# EAGLE schematic stm32f103_ethernet_shield_2 (EAGLE 9.6.2)
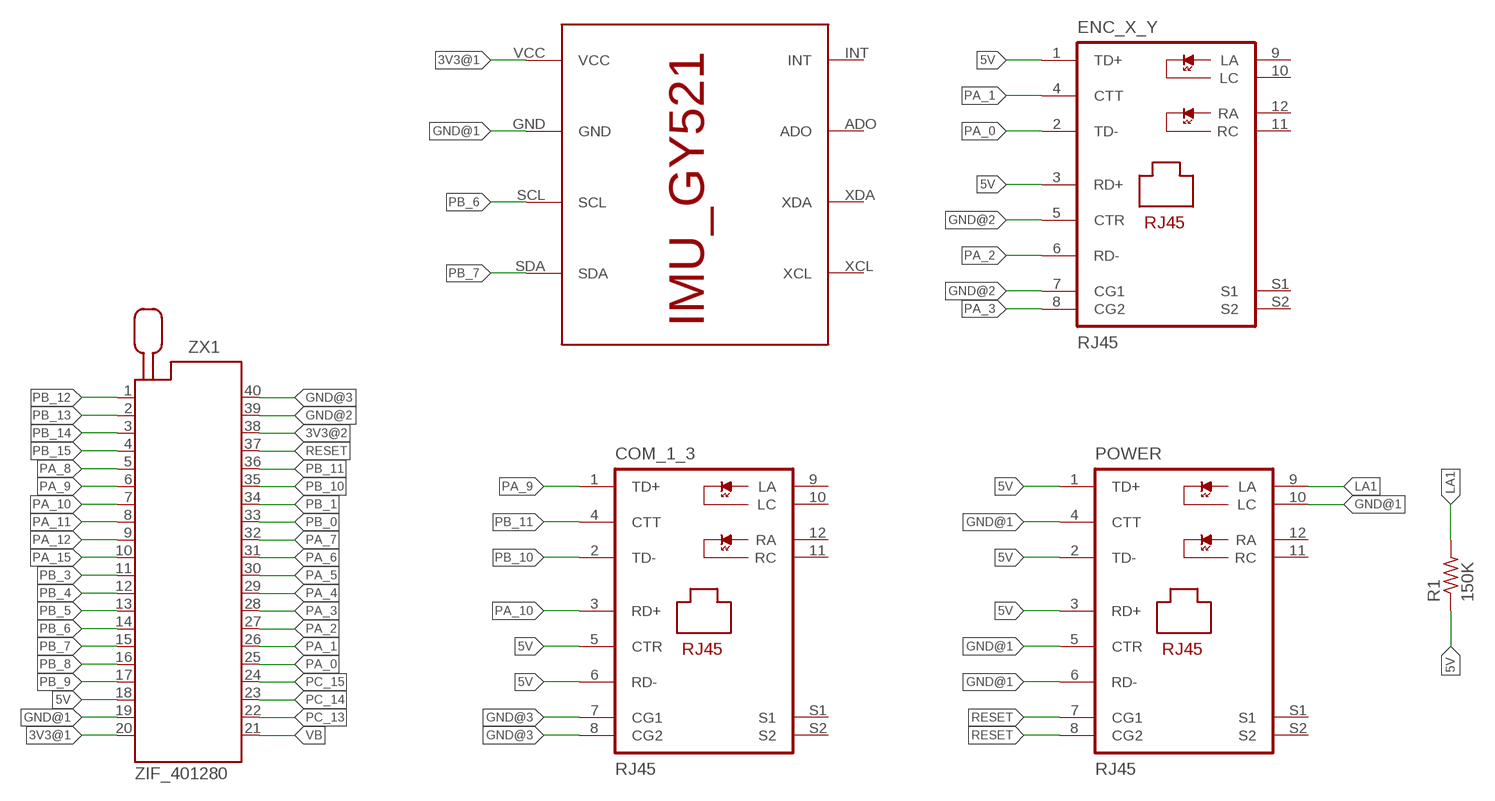
[diagram p0: schematic, sheet 1]

## Parts
COM_1_3  RJ45  RJ45_METAL_LEDS  [J0-A/B/F]
ENC_X_Y  RJ45  RJ45_METAL_LEDS  [J0-A/B/F]
MPU6050  IMU_ROBOCON_GY521  [IMU_GY521]
POWER  RJ45  RJ45_METAL_LEDS  [J0-A/B/F]
R1  150K  RES-7  [0204/7]
ZX1  ZIF_401280  [240-1280-00-0602J]

## Nets
3V3@1: MPU6050.VCC ZX1.20
3V3@2: ZX1.38
5V: COM_1_3.5(CTR) COM_1_3.6(RD-) ENC_X_Y.1(TD+) ENC_X_Y.3(RD+) POWER.1(TD+) POWER.2(TD-) POWER.3(RD+) R1.1 ZX1.18
GND@1: MPU6050.GND POWER.4(CTT) POWER.5(CTR) POWER.6(RD-) POWER.10(LC) ZX1.19
GND@2: ENC_X_Y.5(CTR) ENC_X_Y.7(CG1) ZX1.39
GND@3: COM_1_3.7(CG1) COM_1_3.8(CG2) ZX1.40
LA1: POWER.9(LA) R1.2
PA_0: ENC_X_Y.2(TD-) ZX1.25
PA_1: ENC_X_Y.4(CTT) ZX1.26
PA_2: ENC_X_Y.6(RD-) ZX1.27
PA_3: ENC_X_Y.8(CG2) ZX1.28
PA_4: ZX1.29
PA_5: ZX1.30
PA_6: ZX1.31
PA_7: ZX1.32
PA_8: ZX1.5
PA_9: COM_1_3.1(TD+) ZX1.6
PA_10: COM_1_3.3(RD+) ZX1.7
PA_11: ZX1.8
PA_12: ZX1.9
PA_15: ZX1.10
PB_0: ZX1.33
PB_1: ZX1.34
PB_3: ZX1.11
PB_4: ZX1.12
PB_5: ZX1.13
PB_6: MPU6050.SCL ZX1.14
PB_7: MPU6050.SDA ZX1.15
PB_8: ZX1.16
PB_9: ZX1.17
PB_10: COM_1_3.2(TD-) ZX1.35
PB_11: COM_1_3.4(CTT) ZX1.36
PB_12: ZX1.1
PB_13: ZX1.2
PB_14: ZX1.3
PB_15: ZX1.4
PC_13: ZX1.22
PC_14: ZX1.23
PC_15: ZX1.24
RESET: POWER.7(CG1) POWER.8(CG2) ZX1.37
VB: ZX1.21
Unconnected: COM_1_3.9(LA) COM_1_3.10(LC) COM_1_3.11(RC) COM_1_3.12(RA) COM_1_3.S1 COM_1_3.S2 ENC_X_Y.9(LA) ENC_X_Y.10(LC) ENC_X_Y.11(RC) ENC_X_Y.12(RA) ENC_X_Y.S1 ENC_X_Y.S2 MPU6050.ADO MPU6050.INT MPU6050.XCL MPU6050.XDA POWER.11(RC) POWER.12(RA) POWER.S1 POWER.S2

## Library data of the parts
COM_1_3 POWER = MIA_LIBRARY-2-2-2:RJ45_METAL_LEDS: RJ45 PulseJack w/LEDs
ENC_X_Y = MIA_LIBRARY-2-2-2:RJ45_METAL_LEDS: RJ45 PulseJack w/LEDs; SPICEPREFIX: X
MPU6050 = MIA_LIBRARY-2-2-2:IMU_ROBOCON_GY521
R1 = MIA_LIBRARY-2-2-2:RES-7
ZX1 = MIA_LIBRARY-2-2-2:ZIF_40: Zero Insertion Force Socked Source: http://www.3M.com/ehpd